# EAGLE design DI8bitbox (EAGLE 8.1.0)
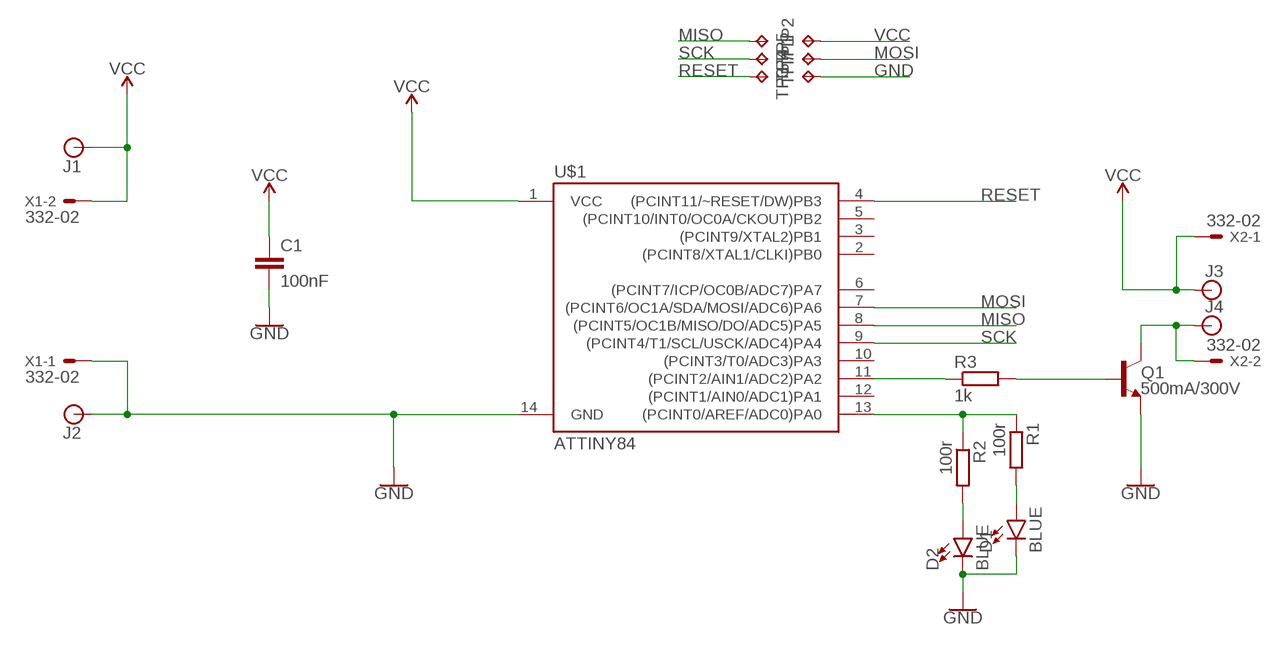
[diagram p0: schematic, sheet 1]

## Parts
C1  100nF  10UF-1206-6.3V-20%  [1206]
D1  BLUE  LED-BLUE1206  [LED-1206]
D2  BLUE  LED-BLUE1206  [LED-1206]
J1  BANANA_CONN  [BANANA_CONN]
J2  BANANA_CONN  [BANANA_CONN]
J3  BANANA_CONN  [BANANA_CONN]
J4  BANANA_CONN  [BANANA_CONN]
Q1  500mA/300V  TRANS_NPN-MMBTA42  [SOT23-3]
R1  100r  R-EU_M0805  [M0805]
R2  100r  R-EU_M0805  [M0805]
R3  1k  R-EU_M0805  [M0805]
TP1  TPTP18R  [TP18R]
TP2  TPTP18R  [TP18R]
TP3  TPTP18R  [TP18R]
TP4  TPTP18R  [TP18R]
TP5  TPTP18R  [TP18R]
TP7  TPTP18R  [TP18R]
U$1  ATTINY84  [SO14]
X1  332-02  [332-02]
X2  332-02  [332-02]

## Nets
GND: C1.2 D1.C D2.C J2.P$1 Q1.2(E) TP7.TP U$1.14(GND) X1.1
MISO: TP5.TP U$1.8((PCINT5/OC1B/MISO/DO/ADC5)PA5)
MOSI: TP1.TP U$1.7((PCINT6/OC1A/SDA/MOSI/ADC6)PA6)
N$1: R1.1 R2.1 U$1.13((PCINT0/AREF/ADC0)PA0)
N$2: D2.A R2.2
N$3: D1.A R1.2
N$5: Q1.1(B) R3.2
N$6: R3.1 U$1.11((PCINT2/AIN1/ADC2)PA2)
RESET: TP3.TP U$1.4((PCINT11/~RESET/DW)PB3)
SCK: TP4.TP U$1.9((PCINT4/T1/SCL/USCK/ADC4)PA4)
SPK: J4.P$1 Q1.3(C) X2.2
VCC: C1.1 J1.P$1 J3.P$1 TP2.TP U$1.1(VCC) X1.2 X2.1
Unconnected: U$1.2((PCINT8/XTAL1/CLKI)PB0) U$1.3((PCINT9/XTAL2)PB1) U$1.5((PCINT10/INT0/OC0A/CKOUT)PB2) U$1.6((PCINT7/ICP/OC0B/ADC7)PA7) U$1.10((PCINT3/T0/ADC3)PA3) U$1.12((PCINT1/AIN0/ADC1)PA1)

## Library data of the parts
C1 = SparkFun-Capacitors:10UF: 10.0µF ceramic capacitors A capacitor is a passive two-terminal electrical component used to store electrical energy temporarily in an electric field.; PROD_ID: CAP-10057; VALUE: 10uF
D1 D2 = SparkFun-LED:LED-BLUE: Blue SMD LED Used in manufacturing of various products at SparkFun Packages: 0603 - SMD 0603 package [Product Link] <http://www.digikey.com/product-detail/en/SMLE12BC7TT86/511-1589-2-ND/1641808> 1206 - SMD1206 package [Product Link] <http://www.digikey.com/product-detail/en/lite-on-inc/LTST-C150TBKT/160-1643-1-ND/573584> SparkFun Products: ESP8266 Thing-Dev Board <https://www.sparkfun.com/products/13711> RedBoard <https://www.sparkfun.com/products/12757>; PROD_ID: DIO-09911
J1-J4 = SparkFun-Connectors:BANANA_CONN: Through-hole Banana Jack Basic PTH connection for banana jack plugs SparkFun Products: Multimeter Kit <https://www.sparkfun.com/products/retired/10956> Banana to Alligator Cable <https://www.sparkfun.com/products/retired/509> Banana to Alligator Coax Cable <https://www.sparkfun.com/products/retired/508> Banana to Banana Cable <https://www.sparkfun.com/products/retired/507> Banana to IC Hook Cables <https://www.sparkfun.com/products/retired/506>
Q1 = SparkFun-DiscreteSemi:TRANS_NPN: NPN transistor Current controlled devices typically used to amplify current or used as a switch. BC547 - COM-08928 <http://www.sparkfun.com/products/8928> (TO-92 45V 100mA) (1.Collector 2.Base 3.Emitter) 2N3904 - COM-00521 <http://www.sparkfun.com/products/521> (TO-92 40V 200mA) (1.Emitter 2.Base 3.Collector) P2N2222A - COM-12852 <http://www.sparkfun.com/products/12852> (TO-92 40V 600mA) (1.Collector 2.Base 3.Emitter); PROD_ID: TRANS-09116
R1-R3 = rcl:R-EU_: RESISTOR, European symbol
TP1-TP5 TP7 = testpad:TP: Test pad
U$1 = SparkFun-IC-Microcontroller:ATTINY84: Atmel 14-pin 2/4/8kB flash uC Datasheet <https://cdn.sparkfun.com/datasheets/Widgets/doc8006.pdf> SparkFun Products Tiny AVR Programmer <https://www.sparkfun.com/products/11801> (PGM-11801) SparkFun Servo Trigger - Continuous Rotation <https://www.sparkfun.com/products/13872> (WIG-13872) SparkFun Servo Trigger <https://www.sparkfun.com/products/13118> (WIG-13118); PROD_ID: IC-11285
X1 X2 = con-garry:332-02: 2 Pin - 2mm Dual Row Source: www.mpe-connector.de / garry_shortform_2012.pdf

## Board
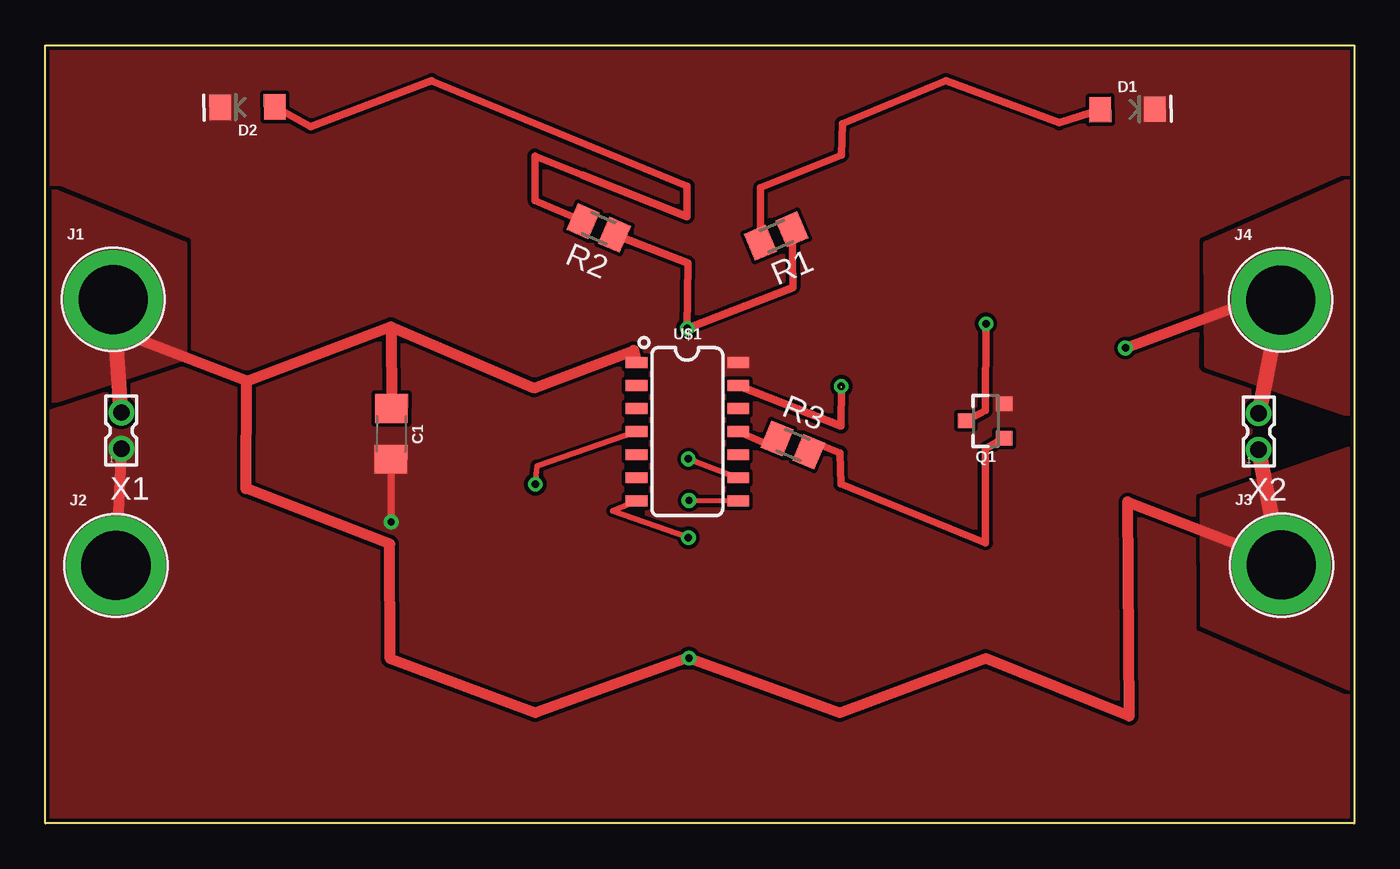
[diagram p1: board, top side]
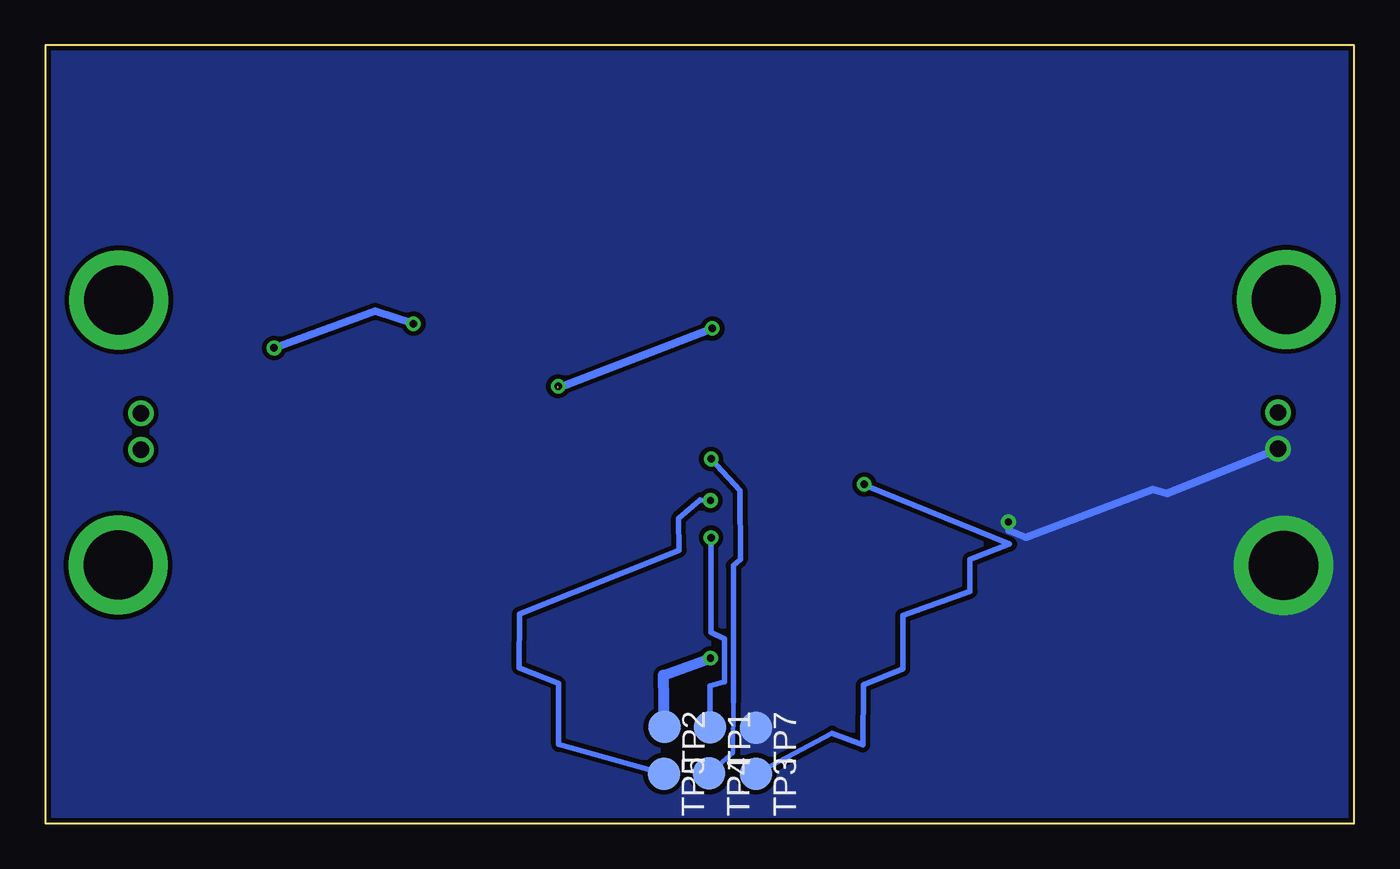
[diagram p2: board, bottom side, seen from below]

Size 72.12 x 42.89 mm. Coordinates in mm from the lower left corner, seen from the top.
Outline: 0,0 0,42.89 72.12,42.89 72.12,0 0,0
Copper layers (1*16): Top 0.035mm / dielectric 1.5mm / Bottom 0.035mm
Design rules "default *": minimum track width 10mil, minimum drill 12mil, track to track 8mil, track to pad 8mil, pad to pad 8mil, via to via 8mil, smd to smd 8mil, copper to edge 8mil, drill to drill 8mil, minimum pad ring 10mil, minimum via ring 8mil, stop-mask expansion 4mil, vias tented up to drill 0mil, thermal gap 10mil

### Footprints (pad centres in the part's own frame; a part is rotated, then mirrored left to right if it is on the bottom)
1206 = smd 1.6 x 1.8: 1 -1.4,0; 2 1.4,0
LED-1206 = smd 1.2 x 1.4: A -1.5,0; C 1.5,0
BANANA_CONN = drill 3.81 pad 5.461: P$1 0,0
SOT23-3 = smd 0.8 x 0.9: 1 -0.95,-1; 2 0.95,-1; 3 0,1.1
M0805 = smd 1.3 x 1.6: 1 -0.95,0; 2 0.95,0
TP18R = smd 1.8 x 1.8: TP 0,0
SO14 = smd 0.6 x 1.2: 1 -3.175,-2.8; 2 -1.905,-2.8; 3 -0.635,-2.8; 4 0.635,-2.8; 5 1.905,-2.8; 6 3.175,-2.8; 7 4.445,-2.8; 8 4.445,2.8; 9 3.175,2.8; 10 1.905,2.8; 11 0.635,2.8; 12 -0.635,2.8; 13 -1.905,2.8; 14 -3.175,2.8
332-02 = drill 0.9 pad 1.27: 1 0,-1; 2 0,1

### Placement (x,y rotation side)
C1  19.06,21.47 269.5 top
D1  59.63,39.36 0.8 top
D2  11.14,39.48 180.6 top
J1  3.74,28.88 0 top
J2  3.89,14.22 0 top
J3  68.11,14.24 0 top
J4  68.07,28.85 0 top
Q1  51.82,22.19 90 top
R1  40.27,32.38 203.2 top
R2  30.5,32.82 156.7 top
R3  41.19,20.85 337.4 top
TP1  35.49,5.3 270 bottom
TP2  38,5.31 270 bottom
TP3  32.97,2.75 270 bottom
TP4  35.54,2.75 270 bottom
TP5  38.04,2.75 270 bottom
TP7  32.97,5.26 270 bottom
U$1  35.38,22.23 270 top
X1  4.18,21.65 0 top
X2  66.86,21.6 0 top

### Tracks (layer width: path | path; a pad name or v marks a point on that pad's centre or on a via)
GND  (via drill 0.41)
  Top 0.406: v19.05,16.62 C1.2
  Top 0.61: X1.1 J2.P$1
  Bottom 0.406: X1.1 10.31,18.18 11.09,18.42 18.08,15.77 19.03,16.14 19,16.51 v19.05,16.62
  pour Bottom (isolate 0.254, no thermals): 0.09,42.52 0.05,-0.41 73.14,-0.32 73.09,43.19 0.05,43.24
  pour Top (rank 4, no thermals): 0.15,43.21 0.19,35.28 7.86,32.29 7.91,25.27 0.24,22.6 0.29,20.65 0.12,-1.04 72.56,-1.04 72.9,7.56 63.66,11.51 63.42,18.16 71.88,21.13 71.93,22.08 63.37,24.94 63.42,32.25 72.19,36.05 71.97,43.11
MISO  (via drill 0.41)
  Top 0.305: v35.47,17.81 U$1.8
  Bottom 0.305: TP5.TP 43.83,4.36 43.84,7.71 46.01,8.58 45.99,11.55 37.19,15.05 37.23,16.82 36.04,17.83 v35.47,17.81
MOSI  (via drill 0.41)
  Top 0.305: v35.44,15.76 31.26,17.23 U$1.7
  Bottom 0.305: 35.37,5.94 TP1.TP 35.5,7.57 34.74,7.8 34.7,7.8 34.7,10.16 35.44,10.54 35.44,10.58 v35.44,15.76
N$1  (via drill 0.41)  (1 unrouted)
  Top 0.305: 38.65,23.94 U$1.13
  Top 0.406: R2.1 35.41,30.9 v35.37,27.29 41.2,29.54 R1.1 | U$1.13 43.85,21.9 v43.86,24.1
  Bottom 0.406: v35.37,27.29 43.87,24
N$2
  Top 0.406: D2.A 14.62,38.42 21.29,40.95 21.31,40.92 35.37,35.13 35.36,33.46 29.6,35.74 26.98,36.79 27,34.32 R2.2
N$3
  Top 0.406: R1.2 39.41,35.05 43.87,36.84 43.91,38.58 49.62,40.94 55.87,38.62 D1.A
N$5
  Top 0.406: Q1.1 51.81,20.63 51.81,15.47 43.83,18.71 43.79,20.43 42.57,20.91 R3.2
N$6
  Top 0.406: U$1.11 40.25,20.69 R3.1
RESET  (via drill 0.41)
  Top 0.305: v27,18.7 27.09,19.71 U$1.4
  Bottom 0.305: TP3.TP 28.77,4.98 27.07,4.32 27.05,7.64 24.87,8.52 24.88,11.47 21.16,12.8 21.17,14.56 18.99,15.4 26.94,18.64 v27,18.7
SCK  (via drill 0.41)
  Top 0.305: U$1.9 v35.43,20.09
  Bottom 0.254: TP4.TP 34.22,3.89 34.21,6.71
  Bottom 0.305: v35.43,20.09 33.85,18.35 33.83,14.56 34.21,14.22 34.21,6.71
SPK  (via drill 0.41, 0.41 pad 0.41)
  Top 0.406: Q1.3 51.8,22.76 v51.84,27.55
  Top 0.61: v59.52,26.21 66.53,28.82 J4.P$1
  Top 0.813: J4.P$1 X2.2
  Bottom 0.406: v59.52,26.21 53.96,28.24 v51.84,27.55
  pour Top (no thermals): 71.44,35.21 64.01,31.93 64.05,25.26 72.41,22.4 72.61,35.85 71.68,35.31
VCC  (via drill 0.41)
  Top 0.305: 19,9.08 18.95,9.1
  Top 0.406: 19.04,27.39 C1.1 | J1.P$1 4.2,27.03
  Top 0.61: 19.04,27.39 C1.1 | U$1.1 32.42,26.08 26.94,24.01 19.04,27.39 11.1,24.38 | 11.1,24.38 11.06,18.46 18.98,15.4 19,9.08 27,6.1 35.48,9.16 v35.47,9.11 43.77,6.1 51.81,9.1 59.73,5.92 59.65,17.73 66.78,14.98 J3.P$1 | 11.1,24.38 4.2,27.03
  Top 0.813: X1.2 J1.P$1 | J3.P$1 X2.1
  Bottom 0.61: TP2.TP 38.06,8.17 v35.47,9.11
  pour Top (isolate 0.305, no thermals): -0.25,35.09 7.62,31.89 7.62,25.72 -0.12,23.16 -0.24,33.64
  pour Top (no thermals): 63.7,17.9 72.62,20.99 72.61,7.05 63.73,10.88 63.7,17.88

### Text on the board
202SilkScreenTopSurfaces: -.. .. --. .. - .- .-.. | - | + | - | + | .. -.. . .- - .. --- -.